# Altium schematic sheet Sheet2.SchDoc
size A; SheetNumber: 1; SheetTotal: 1
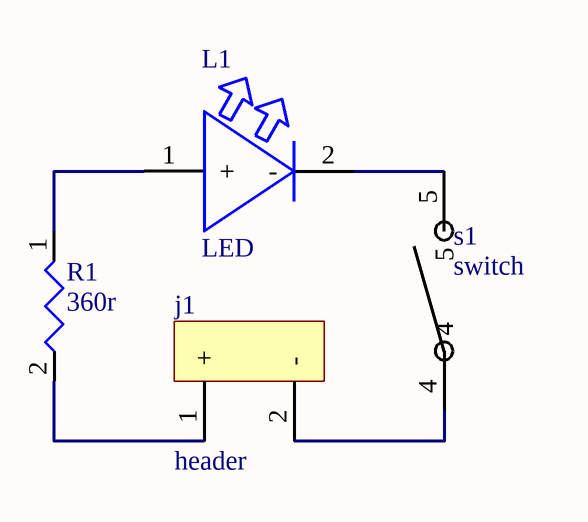
[diagram p0: Sheet2.SchDoc]

## Parts
j1  header  [HDR1X2]
L1  LED  [LED]
R1  360r  [R0805]
s1  switch  [Push button]

## Nets
Netj1_1: j1.1(+) R1.2
Netj1_2: j1.2(-) s1.4
NetL1_1: L1.1(+) R1.1
NetL1_2: L1.2(-) s1.5

## Library data of the parts
j1 = 0022292021: Board Connector, 2 Contact(s), 1 Row(s), Male, Straight, Solder Terminal; Manufacturer: Molex; Supplier: Mouser; Supplier Part Number: 538-22-29-2021; Manufacturer Part Number: 0022292021; RoHS: No; Stock: 4585; Pricing: 1=0.46, 10=0.314, 50=0.314, 100=0.264, 1000=0.252, 10000=0.201 (USD); category: connectors
L1 = 732-12017-2-ND: Single Color LED, Cool White, 2.6mm; Manufacturer: Cree; Manufacturer Part Number: JB3030AWT-P-H65EA0000-N0000001; Supplier: Digikey; Supplier Part Number: 2138-JB3030AWT-P-H65EA0000-N0000001CT-ND; RoHS: Yes; Category: LEDs; Stock: 65459; Pricing: 1=0.1, 10=0.085, 100=0.0753, 500=0.06218, 1000=0.05563 (USD)
R1 = CRCW0805360RFKEA: Fixed Resistor, Metal Glaze/thick Film, 0.125W, 360ohm, 150V, 1% +/-Tol, 100ppm/Cel, Surface Mount, 0805; Manufacturer: Vishay; Power: 125mW; Rated Temperature: 70°C; Temperature Coefficient: 100ppm/°C; Package Height: 0.45mm; Package Length: 2mm; Package Width: 1.25mm; Reference Standard: AEC-Q200; Supplier: Mouser; Supplier Part Number: 71-CRCW0805360RFKEA; Manufacturer Part Number: CRCW0805360RFKEA; RoHS: Yes; Category: Chip SMD Resistors; Stock: 921; Pricing: 1=0.1, 10=0.025, 50=0.025, 100=0.015, 1000=0.012, 10000=0.008 (USD); Mounting Technology: Surface Mount; Pins: 2; Package Shape: Rectangular; Case/Package: 0805; Terminal Finish: Nickel; Min Operating Temperature: -55°C; Max Operating Temperature: 155°C; Tolerance: 1%; JESD-609 Code: e3; Resistor Type: FIXED RESISTOR; Construction: Chip; Package Style: SMTMeter; Packaging: Tape and Reel; Value: 360R; Technology: METAL GLAZE/THICK FILM; Termination: Wraparound; Working Voltage: 150V; Reach SVHC Compliant: Yes; RoHS Compliant: Yes; ComponentLink1URL: https://datasheet.ciiva.com:443/pdfs/VipMasterIC/IC/VISH/VISH-S-A0007266705/VISH-S-A0007266705-1.pdf?src-supplier=IHS+Markit; ComponentLink1Description: https://datasheet.ciiva.com:443/pdfs/VipMasterIC/IC/VISH/VISH-S-A0007266705/VISH-S-A0007266705-1.pdf?src-supplier=IHS+Markit; ComponentLink2URL: https://datasheet.ciiva.com/2467/dcrcwe3-2467773.pdf?src-supplier=Digikey; ComponentLink2Description: https://datasheet.ciiva.com/2467/dcrcwe3-2467773.pdf?src-supplier=Digikey
s1 = G3T12AB: Toggle Switch, SPDT, On-on, Horizontal, 9 PCB Hole Cnt, Solder Terminal, Toggle Column Actuator, Surface Mount-straight; Manufacturer: NKK Switches; Manufacturer Series: G3; Actuator Material: Polyphenylene; End Contact Plating: Gold; End Contact Material: Bronze; Actuator Angle: 28°; Contact DC Max Power Rating R Load: 0.4VA@28VDC; Contact Resistance: 0.08mR; Dielectric Withstand Volts: 500VACV; Electrical Life: 50000Cycles; Insulation Resistance: 500MR; PCB Hole Count: 9; Solderability: WAVE; Actuator Length: 0.15inch; Body Breadth: 5.0038inch; Body Height: 12.9032mm; Body Length or Diameter: 10.9982mm; Bushing Diameter: 0.157inch; Bushing Length: 0.059inch; Sealing: EPOXY; Supplier: Digikey; Supplier Part Number: 360-3268-ND; Manufacturer Part Number: G3T12AB; RoHS: Yes; Category: Toggle Switches; Stock: 11404; Pricing: 1=5.24, 10=4.519, 25=4.2616, 40=4.13475, 80=3.95475, 230=3.69478, 440=3.54341, 945=3.3727 (USD); Mounting Technology: Surface Mount; Contact Material: Bronze; Center Contact Plating: Gold; Housing Material: Polyphenylene; Insulation Material: Polyphenylene; Terminal Finish: Gold; Terminal Material: Bronze; Min Operating Temperature: -25°C; Max Operating Temperature: 70°C; JESD-609 Code: e4; Actuator Type: Toggle; Contact Function: On-On; Switch Action: HORIZONTAL; Switch Function: SPDT; Switch Type: Toggle; Termination: Solder; Terminal Length: 0inch; Reach SVHC Compliant: Yes; RoHS Compliant: Yes; ComponentLink1URL: https://datasheet.ciiva.com:443/pdfs/VipMasterIC/IC/NKSW/NKSWS00071/NKSWS00071-1.pdf?src-supplier=IHS+Markit; ComponentLink1Description: https://datasheet.ciiva.com:443/pdfs/VipMasterIC/IC/NKSW/NKSWS00071/NKSWS00071-1.pdf?src-supplier=IHS+Markit; ComponentLink2URL: https://datasheet.ciiva.com/28398/1783573-28398363.pdf?src-supplier=Element14; ComponentLink2Description: https://datasheet.ciiva.com/28398/1783573-28398363.pdf?src-supplier=Element14